# Altium schematic sheet LV solo mission schematic.SchDoc
size A3; SheetNumber: 1; SheetTotal: 1
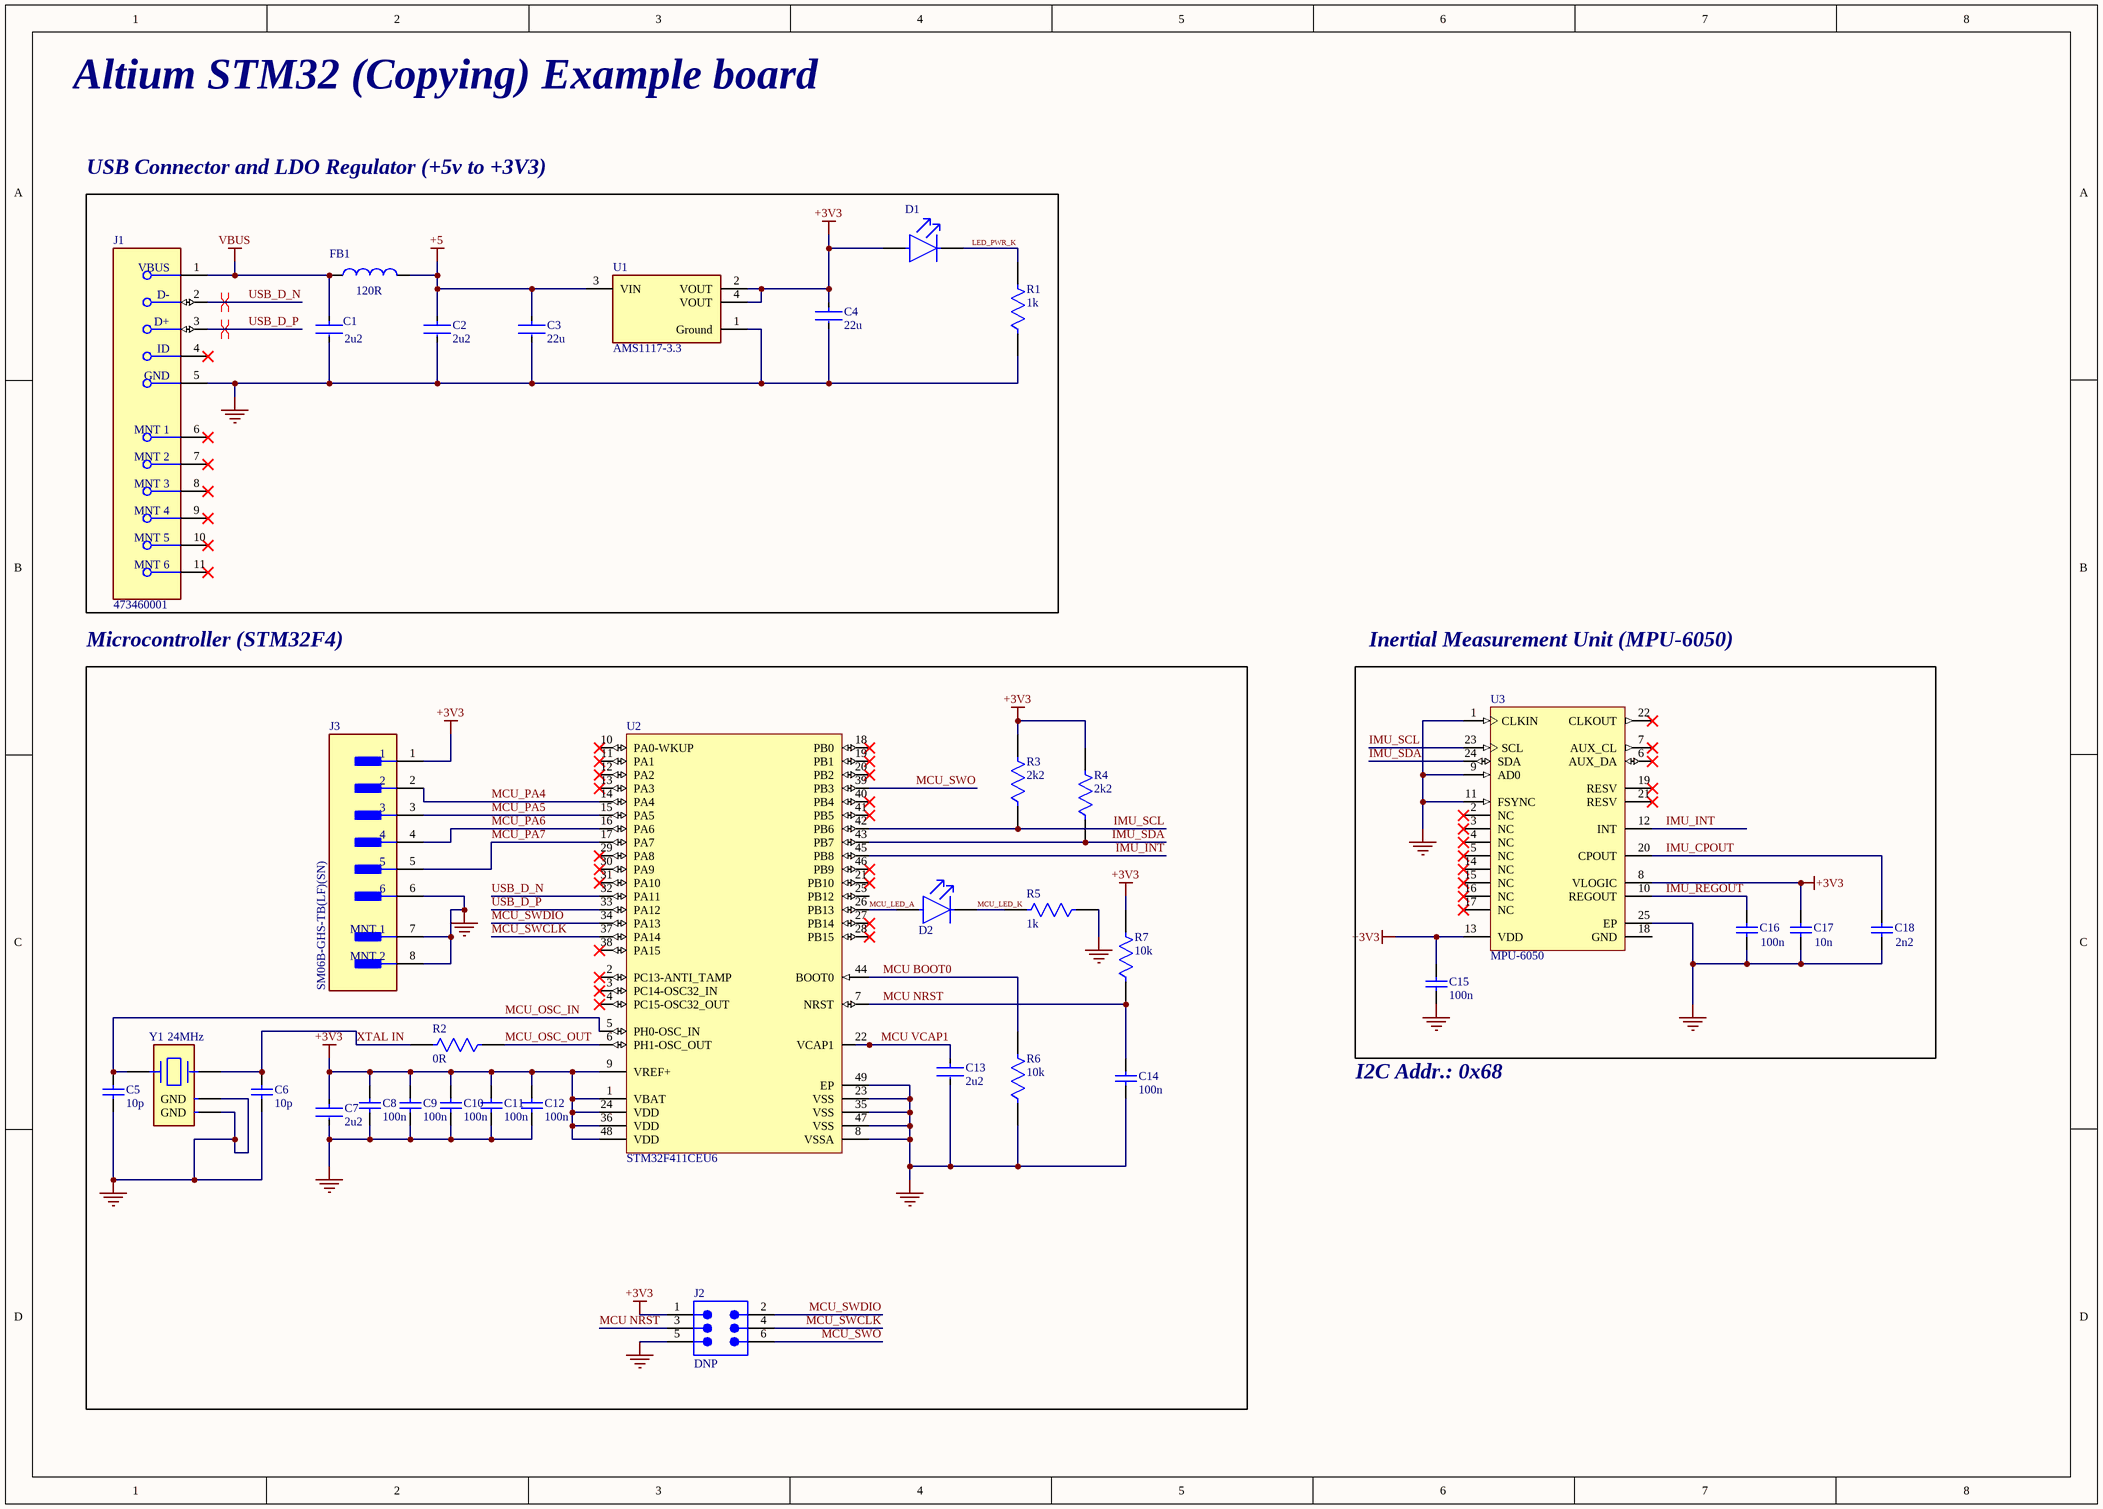
[diagram p0: LV solo mission schematic.SchDoc]

## Parts
C1  2u2  [FP-GRM188-0_2-IPC_B]
C2  2u2  [FP-GRM188-0_2-IPC_B]
C3  22u  [FP-GRM21B-0_2-e0_2_0_7-MFG]
C4  22u  [FP-GRM21B-0_2-e0_2_0_7-MFG]
C5  10p  [CAPC1005X55X25LL05T05]
C6  10p  [CAPC1005X55X25LL05T05]
C7  2u2  [FP-GRM188-0_2-IPC_B]
C8  100n  [CAPC1005X55X30NL05T10]
C9  100n  [CAPC1005X55X30NL05T10]
C10  100n  [CAPC1005X55X30NL05T10]
C11  100n  [CAPC1005X55X30NL05T10]
C12  100n  [CAPC1005X55X30NL05T10]
C13  2u2  [FP-GRM188-0_2-IPC_B]
C14  100n  [CAPC1005X55X30NL05T10]
C15  100n  [CAPC1005X55X30NL05T10]
C16  100n  [CAPC1005X55X30NL05T10]
C17  10n  [CAPC1005X55X30NL05T10]
C18  2n2  [CAPC1005X55X30NL05T10]
D1  (no value)  [FP-APG1005CGC-T-MFG]
D2  APHHS1005SURCK  [FP-APHHS1005SURCK-MFG]  (value not drawn)
FB1  120R  [WE-CBF HF_0603_HC]
J1  473460001  [FP-473460001-MFG]
J2  DNP  [61300621121]
J3  SM06B-GHS-TB(LF)(SN)  [FP-SM06B-GHS-TB_LF_SN-MFG]
R1  1k  [FP-CR0402-MFG]
R2  0R  [FP-CR0402-MFG]
R3  2k2  [FP-CR0402-MFG]
R4  2k2  [FP-CR0402-MFG]
R5  1k  [FP-CR0402-MFG]
R6  10k  [FP-CR0402-MFG]
R7  10k  [FP-CR0402-MFG]
U1  AMS1117-3.3  [FP-AMS1117-IPC_C]
U2  STM32F411CEU6  [STM-UFQFPN48_L]
U3  MPU-6050  [IS-QFN-24_V]
Y1  24MHz  [FP-ABM8W-MFG]

## Blocks framed on the sheet
USB Connector and LDO Regulator (+5v to +3V3): C1-C4 D1 FB1 J1 R1 U1
Microcontroller (STM32F4): C5-C14 D2 J2 J3 R2-R7 U2 Y1
Inertial Measurement Unit (MPU-6050): C15-C18 U3

## Nets
+3V3: C4.1 C7.1 C8.1 C9.1 C10.1 C11.1 C12.1 C15.1 C17.1 D1.2(A) J2.1 J3.1 R3.2 R4.2 R7.2 U1.2(VOUT) U1.4(VOUT) U2.1(VBAT) U2.9(VREF+) U2.24(VDD) U2.36(VDD) U2.48(VDD) U3.8(VLOGIC) U3.13(VDD)
+5: C2.1 C3.1 FB1.2 U1.3(VIN)
GND: C1.2 C2.2 C3.2 C4.2 C5.1 C6.1 C7.2 C8.2 C9.2 C10.2 C11.2 C12.2 C13.2 C14.2 C15.2 C16.2 C17.2 C18.2 J1.5(GND) J2.5 J3.6 J3.7(MNT_1) J3.8(MNT_2) R1.1 R5.1 R6.1 U1.1(Ground) U2.8(VSSA) U2.23(VSS) U2.35(VSS) U2.47(VSS) U2.49(EP) U3.1(CLKIN) U3.9(AD0) U3.11(FSYNC) U3.25(EP) Y1.2(GND) Y1.4(GND)
VBUS: C1.1 FB1.1 J1.1(VBUS)
IMU_CPOUT: C18.1 U3.20(CPOUT)
IMU_INT: U2.45(PB8) U3.12(INT)
IMU_REGOUT: C16.1 U3.10(REGOUT)
IMU_SCL: R3.1 U2.42(PB6) U3.23(SCL)
IMU_SDA: R4.1 U2.43(PB7) U3.24(SDA)
LED_PWR_K: D1.1(C) R1.2
MCU BOOT0: R6.2 U2.44(BOOT0)
MCU NRST: C14.1 J2.3 R7.1 U2.7(NRST)
MCU VCAP1: C13.1 U2.22(VCAP1)
MCU_LED_A: D2.2(A) U2.26(PB13)
MCU_LED_K: D2.1(C) R5.2
MCU_OSC_IN: C5.2 U2.5(PH0-OSC_IN) Y1.1
MCU_OSC_OUT: R2.1 U2.6(PH1-OSC_OUT)
MCU_PA4: J3.2 U2.14(PA4)
MCU_PA5: J3.3 U2.15(PA5)
MCU_PA6: J3.4 U2.16(PA6)
MCU_PA7: J3.5 U2.17(PA7)
MCU_SWCLK: J2.4 U2.37(PA14)
MCU_SWDIO: J2.2 U2.34(PA13)
MCU_SWO: J2.6 U2.39(PB3)
USB_D_N: J1.2(D-) U2.32(PA11)
USB_D_P: J1.3(D+) U2.33(PA12)
XTAL IN: C6.2 R2.2 Y1.3

Not connected (* = marked no-connect by the designer): J1 4(ID)* 6(MNT_1)* 7(MNT_2)* 8(MNT_3)* 9(MNT_4)* 10(MNT_5)* 11(MNT_6)*; U2 2(PC13-ANTI_TAMP)* 3(PC14-OSC32_IN)* 4(PC15-OSC32_OUT)* 10(PA0-WKUP)* 11(PA1)* 12(PA2)* 13(PA3)* 18(PB0)* 19(PB1)* 20(PB2)* 21(PB10)* 25(PB12) 27(PB14)* 28(PB15)* 29(PA8)* 30(PA9)* 31(PA10)* 38(PA15)* 40(PB4)* 41(PB5)* 46(PB9)*; U3 2(NC)* 3(NC)* 4(NC)* 5(NC)* 6(AUX_DA)* 7(AUX_CL)* 14(NC)* 15(NC)* 16(NC)* 17(NC)* 18(GND) 19(RESV)* 21(RESV)* 22(CLKOUT)*

## Layout directives
differential pair; differential pair class DIFF_USB: USB_D_N, USB_D_P

## Notes on the sheet
- Altium STM32 (Copying) Example board
- I2C Addr.: 0x68

## Library data of the parts
C1 C2 C7 C13 = CMP-06035-000124-3: CAP CER 2.2UF 16V X7S 0603; Tolerance: 10%; Mount: Surface Mount; Width: 0.031inch; Voltage Rating (DC): 16V; Max Operating Temperature: 125°C; Termination: SMD/SMT; Resistor Type: Ceramic; Voltage Rating: 16V; Height: 0.8mm; Packaging: Tape and Reel; Package Quantity: 4000; Case Code (Metric): 1608; Thickness: 0.039inch; Case/Package: 0603; Depth: 0.8mm; Min Operating Temperature: -55°C; Length: 1.6mm; Case Code (Imperial): 0603; Dielectric: X7S; Capacitance: 2.2uF; Weight: 0.000222oz
C3 C4 = CMP-06035-012913-1: Chip Multilayer Ceramic Capacitors for General Purpose, 0805, 22uF, X6S, 22%, 20%, 16V; Packaging: Tape and Reel; Dielectric: X6S; Case Code (Imperial): 0805; Weight: 0.000335oz; Case Code (Metric): 2012; Thickness: 0.057inch; Min Operating Temperature: -55°C; Voltage Rating (DC): 16V; Tolerance: 20%; Width: 1.25mm; Voltage Rating: 16V; Mount: Surface Mount; Capacitance: 22uF; Length: 0.079inch; Lead Free: Lead Free; Case/Package: 0805; Package Quantity: 3000; Height: 1.25mm; Max Operating Temperature: 105°C; Termination: SMD/SMT
C5 C6 = CMP-2008-01462-1: Part Number: VJ0402A100KXJCW1BC; Manufacturer: Vitramon
C8-C12 C14-C18 = CMP-2008-03085-1: Part Number: C0402C104K4RALTU; Manufacturer: Kemet
D1 = CMP-44529-000029-1: LED GREEN CLEAR CHIP SMD; Forward Voltage: 2V; Lens Color: Colorless; Test Current: 20mA; Dominant Wavelength: 571nm; Viewing Angle: 120°; Luminous Intensity: 35mcd; Width: 0.5mm; Case Code (Imperial): 0402; Color: Green; Package Quantity: 1; Case/Package: 0402; Packaging: Tape and Reel; Height: 0.25mm; Mount: Surface Mount; Case Code (Metric): 1005; Length: 1mm; Lead Free: Lead Free; Lens Transparency: Clear
D2 = CMP-2000-05787-2: LED RED CLEAR CHIP SMD; Forward Current: 20mA; Number of LEDs: 1; Dominant Wavelength: 630nm; Luminous Intensity: 220mcd; Wavelength: 635nm; Forward Voltage: 1.95V; Viewing Angle: 120°; Case/Package: 0402; Length: 1mm; Packaging: Tape and Reel; Lens Color: Clear; Width: 0.5mm; Test Current: 20mA; Lead Free: Lead Free; Min Operating Temperature: -40°C; Illumination Color: Red; Max Operating Temperature: 85°C; Mount: Surface Mount; Package Quantity: 2000; Lens Style: Clear; Case Code (Imperial): 0402; Height: 0.6mm; Number of Pins: 2; Case Code (Metric): 1005; Color: Red
FB1 = CMP-0220-00101-3: Ferrite Bead (emi Suppression), 1.6X0.8X0.8MM (0603), 600O Impedance At 100 Mhz; Current Rating: 400mA; DC Resistance (DCR): 220mΩ; Max Current Rating: 500mA; Impedance: 600Ω; Tolerance: 25%; Resistance: 350mΩ; Number of Lines: 1; Test Frequency: 100MHz; Height: 800µm; Min Operating Temperature: -55°C; Length: 1.6mm; Width: 800µm; Case Code (Imperial): 0603; Depth: 800µm; Number of Pins: 2; Case Code (Metric): 1608; Case/Package: SMD/SMT; Lead Free: Lead Free; Core Material: Ferrite; Max Operating Temperature: 125°C; Termination: SMD/SMT; RoHS: Compliant; REACH SVHC: Unknown; Max DC Current: 500mA; Mount: Surface Mount
J1 = CMP-2000-05246-2: CONN RCPT USB2.0 MICRO B SMD R/A; Manufacturer: Molex; Conn Orientation: Right Angle; Is Female: yes; Shielding: true; Pitch: 0.65mm; Number Of Contacts: 5; Voltage Rating: 30V; Current Rating: 1.8A; Device Class L2: USB Connectors; Digikey Description: CONN RCPT USB2.0 MICRO B SMD R/A; Height: 2.945mm; RoHS: TRUE; ComponentLink2Description: Datasheet; Octopart: https://octopart.com/47346-0001-molex-7164928; Automotive: No; Package: 0; Category: Conn; Device Class L1: Connectors; Usb Standard: USB 2.0; Temperature: -30°C to +85°C; Temperature Range Low: -30°C; Footprint Url: https://www.molex.com/pdm_docs/sd/473460001_sd.pdf; ComponentLink2URL: https://www.molex.com/webdocs/datasheets/pdf/en-us/0473460001_IO_CONNECTORS.pdf; Lead Free: Yes; Manufacturer Part Number: 473460001; Contact Material: Gold,Nickel; Temperature Range High: +85°C; Device Class L3: unset
J2 = CMP-1502-01072-4: THT Vertical Pin Header WR-PHD, Pitch 2.54 mm, Dual Row, 6 pins; Voltage Rating: 250V; Contact Resistance: 20mΩ; Gender: Male; Number of Positions: 6; Connector Type: Male Pin; Current Rating: 3A; Row Spacing: 2.54mm; Number of Pins: 6; Min Operating Temperature: -40°C; Termination: Solder; Height: 8.89mm; Number of Rows: 2; Lead Pitch: 2.54mm; Packaging: Bulk; RoHS: Compliant; Operating Supply Voltage: 250V; Number of Contacts: 6; Color: Black; Mount: Through Hole; Orientation: Vertical; Max Operating Temperature: 105°C; Pitch: 2.54mm; Contact Mating Length: 5.9944mm; Contact Plating: Gold; Contact Material: Gold
J3 = CMP-17439-000061-1: CONN HEADER SMD R/A 6POS 1.25MM; Number of Contacts: 6; Voltage Rating: 50V; Current Rating: 1A; Connector Type: Outer Shroud Contact; Contact Resistance: 50mR; Orientation: Right Angle; Max Operating Temperature: 85°C; Mount: Surface Mount; Packaging: Tape and Reel; Contact Plating: Tin; Depth: 4.05mm; Max Voltage Rating (AC): 50V; Lead Free: Lead Free; Pitch: 1.25mm; Number of Positions: 6; Max Current Rating: 1A; Termination: Solder; Min Operating Temperature: -25°C; Housing Color: Beige; Fastening Type: Ramp; Length: 10.75mm; Color: Natural; Contact Material: Bronze; Housing Material: Polyamide; Number of Rows: 1
R1-R7 = CMP-07231-005993-1: Sulfur-Resistant, AEC-Q200 Compliant Chip Resistors 0402 10kΩ 0.063W 1% 100ppm/°C
U1 = CMP-209535-000001-1: LDO Voltage Regulators 1A, 3.3V; Manufacturer: Advanced Monolithic Systems; Dropout Voltage: 1.1V; Output Type: Fixed; Nominal Supply Current: 5mA; Max Power Dissipation: 1.2W; Max Supply Voltage: 15V; Number Of Outputs: 1; Standoff Height: 0.64mm; Max Junction Temp: +125°C; Height: 1.8mm; Package: AMS1117; Device Class L2: Power Management ICs; ComponentLink2Description: Datasheet; ComponentLink2URL: http://www.advanced-monolithic.com/pdf/ds1117.pdf; Category: IC; RoHS: TRUE; Automotive: No; Device Class L1: Integrated Circuits (ICs); Output Current: 1A; Device Class L3: Voltage Regulators - Linear; Temperature: -40°C to +125°C; Output Voltage: 3.3V; Manufacturer Part Number: AMS1117-3.3; Temperature Range Low: -40°C; Octopart: https://octopart.com/ams1117-3.3-advanced+monolithic+systems-25899300; Lead Free: Yes; Ipc Land Pattern Name: SOT229P700X180-4; Temperature Range High: +125°C
U2 = CMP-0243-00165-1: ARM Cortex-M4 32-bit MCU+FPU, 512 KB Flash, 128 KB RAM, 36 I/Os, 48-Pin UFQFPN, -40 to 85 degC, Tray; Operating Frequency(F) (Processor speed) (MHz): 100; FLASH Size (Prog) (kB): 512; Internal RAM Size (kB): 128; I/Os (High Current): 36; Supply Voltage(Vcc) min (V): 1.7; Package Reference: 48-Pin Ultra Thin Fine Pitch Quad Flat No-Lead, 7 x 7 x 0.6 mm Body, 0.5 mm Pitch, Exposed Pad; ComponentLink1Description: Manufacturer URL; ComponentLink1URL: http://www.st.com/; Packing: Tray; Package Description: UFQFPN48; Core: ARM Cortex-M4; ComponentLink2Description: Datasheet; ComponentLink2URL: http://www.st.com/st-web-ui/static/active/en/resource/technical/document/datasheet/DM00115249.pdf; DatasheetVersion: Rev. 6; Mounting Technology: Surface Mount
U3 = CMP-1753-00002-2: 3-Axis Gyroscope, Accelerometer and a Digital Motion Processor(TM) (DMP), 2.375 to 3.46 V, -40 to 85 degC, 24-Pin QFN, RoHS, Tape and Reel; Manufacturer: InvenSense; Featured Product: MPU-60506-Axis,IntegratedI²CSolution; Other Names: 1428-1007-2 / MPU6050; Sensor Type: MotionTracking; Online Catalog: MPU-6000™Series; Unit PriceUSD: Digital; Datasheet Version: Rev. 3.3, 05/2012; Category: Sensors,Transducers; Datasheet URL: http://datasheet.octopart.com/MPU-6050-InvenSense-datasheet-14421344.pdf; Family: Multifunction; Standard Package: 5,000; Manufacturer URL: http://www.invensense.com/; Output Type: Digital; Dynamic Catalog: MPU-6000™Series
Y1 = CMP-27762-013939-3: Crystal 24MHz ±10ppm (Tol) ±10ppm (Stability) 7pF FUND 50Ω 4-Pin SMD T/R